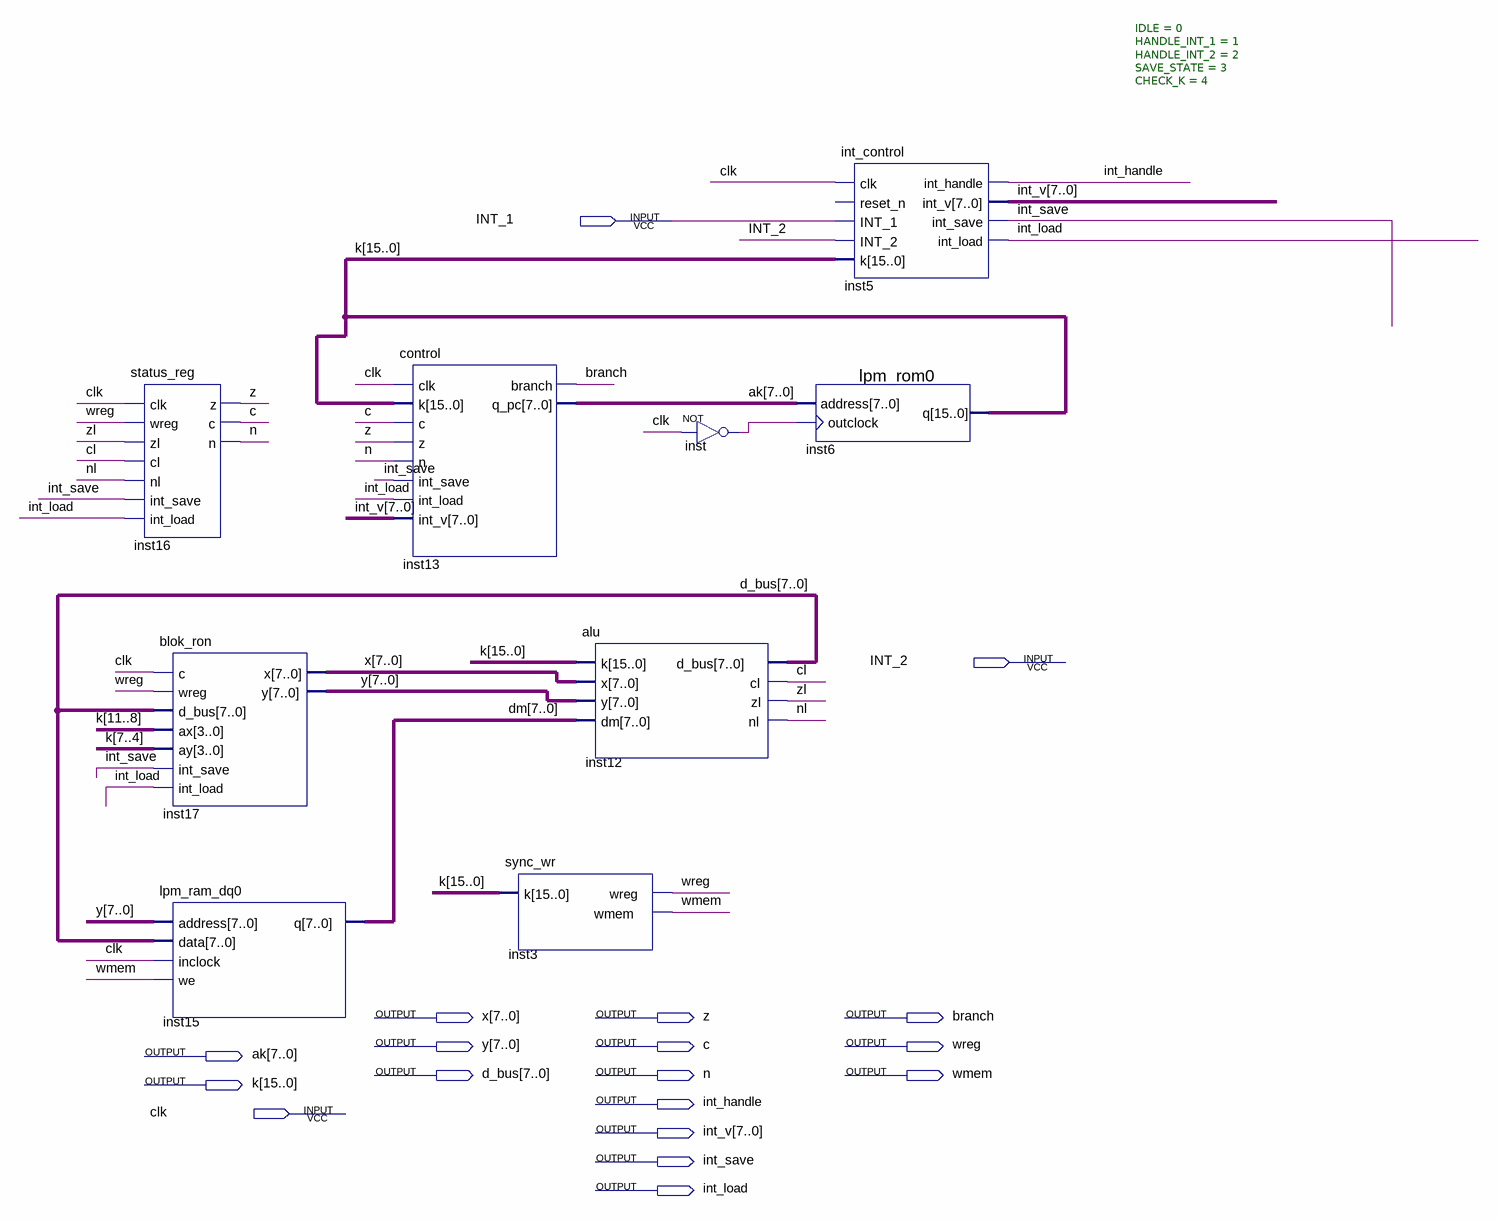
[diagram p0: schematic sheet]
// Quartus schematic cpu_int.bdf as structural Verilog: 9 symbols, 18 pins
module cpu_int (
  input  INT_1,
  input  INT_2,
  input  clk,
  output [7:0] x,
  output z,
  output branch,
  output [7:0] y,
  output c,
  output wreg,
  output [7:0] ak,
  output [7:0] d_bus,
  output n,
  output wmem,
  output [15:0] k,
  output int_handle,
  output [7:0] int_v,
  output int_save,
  output int_load
);

  wire cl, inst_out, nl, zl;
  wire [7:0] dm;

  status_reg inst16 (
    .clk(clk), .wreg(wreg), .zl(zl), .cl(cl), .nl(nl), .int_save(int_save), .int_load(int_load), .z(z),
    .c(c), .n(n));
  blok_ron inst17 (
    .c(clk), .wreg(wreg), .d_bus(d_bus), .ax(k[11:8]), .ay(k[7:4]), .int_save(int_save), .int_load(int_load),
    .x(x), .y(y));
  lpm_ram_dq0 inst15 (.address(y), .data(d_bus), .inclock(clk), .we(wmem), .q(dm));
  control inst13 (
    .clk(clk), .k(k), .c(c), .z(z), .n(n), .int_save(int_save), .int_load(int_load), .int_v(int_v),
    .branch(branch), .q_pc(ak));
  sync_wr inst3 (.k(k), .wreg(wreg), .wmem(wmem));
  alu inst12 (.k(k), .x(x), .y(y), .dm(dm), .d_bus(d_bus), .cl(cl), .zl(zl), .nl(nl));
  not inst (inst_out, clk);
  lpm_rom0 inst6 (.address(ak), .outclock(inst_out), .q(k));
  int_control #(.IDLE(0), .HANDLE_INT_1(1), .HANDLE_INT_2(2), .SAVE_STATE(3), .CHECK_K(4)) inst5 (
    .clk(clk), .INT_1(INT_1), .INT_2(INT_2), .k(k), .int_handle(int_handle), .int_v(int_v),
    .int_save(int_save), .int_load(int_load));  // open: reset_n
endmodule
